# Altium schematic sheet MCU.SchDoc
size A; SheetNumber: 2; SheetTotal: 4
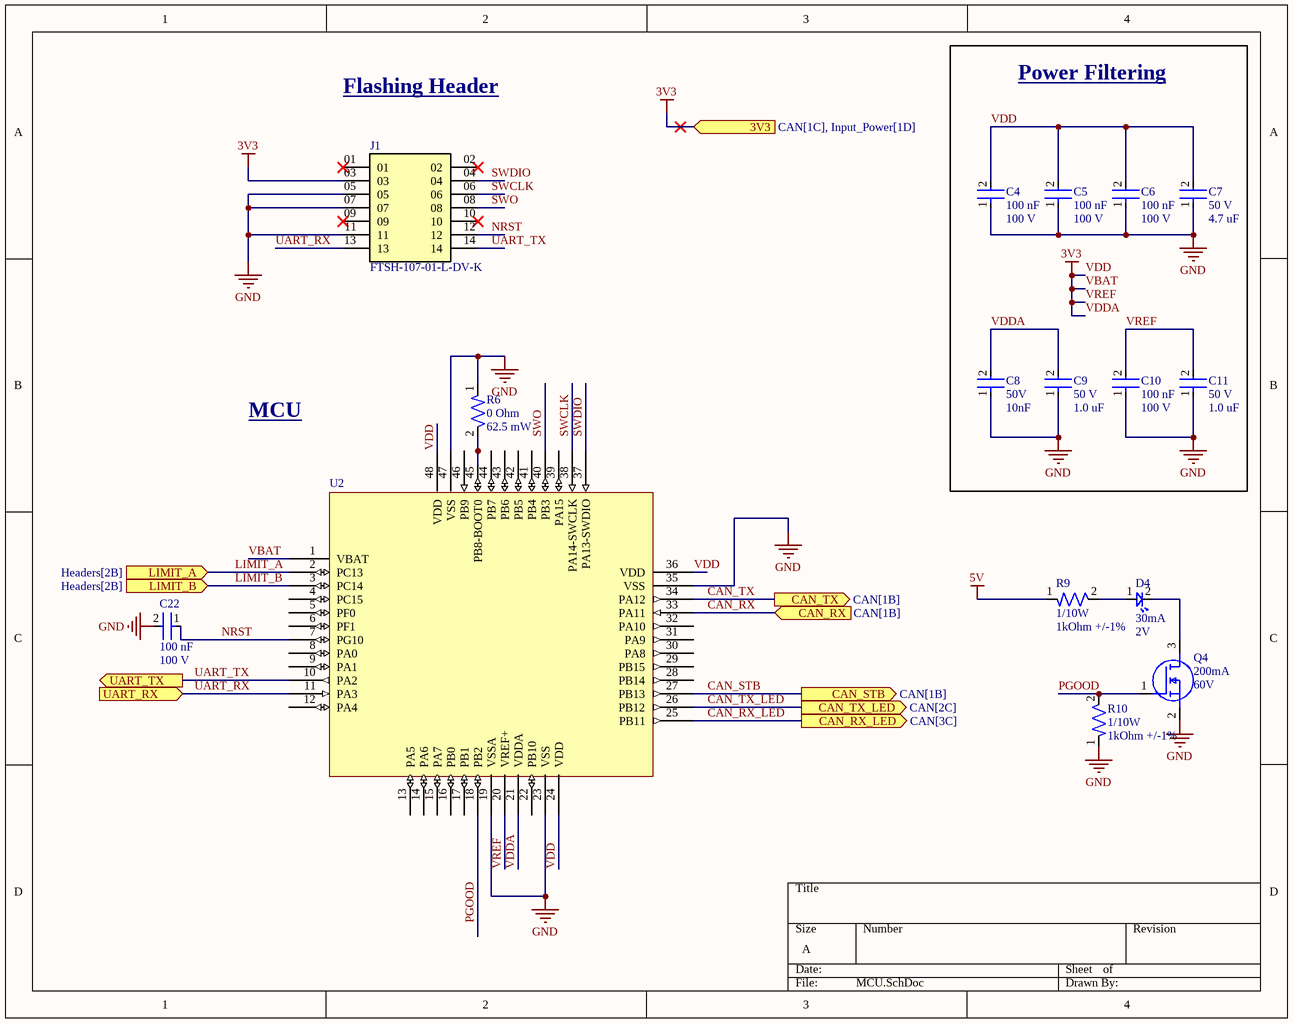
[diagram p0: MCU.SchDoc]

## Parts
C4  Capacitance: 100 nF  Voltage: 100 V  [CAP-0603]  (hidden comment: CC0603KRX7R0BB104)
C5  Capacitance: 100 nF  Voltage: 100 V  [CAP-0603]  (hidden comment: CC0603KRX7R0BB104)
C6  Capacitance: 100 nF  Voltage: 100 V  [CAP-0603]  (hidden comment: CC0603KRX7R0BB104)
C7  Voltage: 50 V  Capacitance: 4.7 uF  [CAP-0805]  (hidden comment: CC0805KKX5R9BB475)
C8  Voltage: 50V  Capacitance: 10nF  [CAP-0805]  (hidden comment: GRM2195C1H103JA01D)
C9  Voltage: 50 V  Capacitance: 1.0 uF  [CAP-0805]  (hidden comment: CC0805KKX7R9BB105)
C10  Capacitance: 100 nF  Voltage: 100 V  [CAP-0603]  (hidden comment: CC0603KRX7R0BB104)
C11  Voltage: 50 V  Capacitance: 1.0 uF  [CAP-0805]  (hidden comment: CC0805KKX7R9BB105)
C22  Capacitance: 100 nF  Voltage: 100 V  [CAP-0603]  (hidden comment: CC0603KRX7R0BB104)
D4  Forward Current: 30mA  Forward Voltage: 2V  [LED-0603]  (hidden comment: BL-HKC36G-AV-TRB)
J1  FTSH-107-01-L-DV-K  [SAMTEC_FTSH-107-01-L-DV-K]
Q4  Continuous Current: 200mA  Voltage: 60V  [IC-SOT23-3]  (hidden comment: T2N7002AK,LM)
R6  Resistance: 0 Ohm  Power: 62.5 mW  [RES-0402]  (hidden comment: RC0402FR-070RL)
R9  Power Rating: 1/10W  Resistance: 1kOhm +/-1%  [RES-0603]  (hidden comment: RT0603FRE131KL)
R10  Power Rating: 1/10W  Resistance: 1kOhm +/-1%  [RES-0603]  (hidden comment: RT0603FRE131KL)
U2  STM32G431CBT6  [IC-LQFP48]  (value not drawn)

## Blocks framed on the sheet
Power Filtering: C4-C11

## Ports
3V3 (in, see CAN[1C], Input_Power[1D]), CAN_RX (in, see CAN[1B]), CAN_RX_LED (out, see CAN[3C]), CAN_STB (out, see CAN[1B]), CAN_TX (out, see CAN[1B]), CAN_TX_LED (out, see CAN[2C]), LIMIT_A (in, see Headers[2B]), LIMIT_B (in, see Headers[2B]), UART_RX (in), UART_TX (out)

## Nets
5V: R9.1
GND: C4.1 C5.1 C6.1 C7.1 C8.1 C9.1 C10.1 C11.1 C22.2 J1.05 J1.07 J1.11 Q4.2(S) R6.1 R10.1 U2.19(VSSA) U2.23(VSS) U2.35(VSS) U2.47(VSS)
VBAT: C4.2 C5.2 C6.2 C7.2 C8.2 C9.2 C10.2 C11.2 J1.03 U2.1(VBAT) U2.20(VREF+) U2.21(VDDA) U2.24(VDD) U2.36(VDD) U2.48(VDD) ; port 3V3  [also labelled 3V3, VDD, VDDA, VREF]
CAN_RX: U2.33(PA11) ; port CAN_RX
CAN_RX_LED: U2.25(PB11) ; port CAN_RX_LED
CAN_STB: U2.27(PB13) ; port CAN_STB
CAN_TX: U2.34(PA12) ; port CAN_TX
CAN_TX_LED: U2.26(PB12) ; port CAN_TX_LED
LIMIT_A: U2.2(PC13) ; port LIMIT_A
LIMIT_B: U2.3(PC14) ; port LIMIT_B
NRST: C22.1 J1.12 U2.7(PG10)
PGOOD: Q4.1(G) R10.2 U2.18(PB2)
SWCLK: J1.06 U2.38(PA14-SWCLK)
SWDIO: J1.04 U2.37(PA13-SWDIO)
SWO: J1.08 U2.40(PB3)
UART_RX: J1.13 U2.11(PA3) ; port UART_RX
UART_TX: J1.14 U2.10(PA2) ; port UART_TX
NetD4_1: D4.1 R9.2
NetD4_2: D4.2 Q4.3(D)
NetR6_2: R6.2 U2.45(PB8-BOOT0)

Not connected (* = marked no-connect by the designer): J1 01* 02* 09* 10*; U2 4(PC15) 5(PF0) 6(PF1) 8(PA0) 9(PA1) 12(PA4) 13(PA5) 14(PA6) 15(PA7) 16(PB0) 17(PB1) 22(PB10) 28(PB14) 29(PB15) 30(PA8) 31(PA9) 32(PA10) 39(PA15) 41(PB4) 42(PB5) 43(PB6) 44(PB7) 46(PB9)

## Notes on the sheet
- Flashing Header
- MCU

## Library data of the parts
C4-C6 C10 C22 = CAP-100N-0001: CAP CER 0.1UF 100V X7R 0603; Device Class: Ceramic; Size: 0603; ComponentLink1Description: Datasheet; ComponentLink1URL: https://www.yageo.com/upload/media/product/app/datasheet/mlcc/upy-np0x7r_mv_100-to-630v.pdf
C7 = CAP-4.7U-0002: CAP CER 4.7UF 50V X5R 0805; ComponentLink2Description: Datasheet; ComponentLink2URL: http://www.yageo.com/documents/recent/UPY-GPHC_Y5V_6.3V-to-50V_8.pdf; Device Class: Ceramic; Size: 0805
C8 = CAP-10N-0001: CAP CER 10000PF 50V C0G/NP0 0805; Device Class: Ceramic; Size: 0805; ComponentLink1Description: Datasheet; ComponentLink1URL: https://search.murata.co.jp/Ceramy/image/img/A01X/G101/ENG/GRM2195C1H103JA01-01.pdf
C9 C11 = CAP-1U-0001: CAP CER 1UF 50V X7R 0805; ComponentLink2URL: https://www.yageo.com/upload/media/product/productsearch/datasheet/mlcc/UPY-GPHC_X7R_6.3V-to-250V_24.pdf; ComponentLink2Description: Datasheet; Device Class: Ceramic; Size: 0805
D4 = LED-0001: LED YELLOW CLEAR 0603 SMD; ComponentLink1Description: Datasheet; ComponentLink1URL: https://www.americanbrightled.com/pdffiles/led-components/smt/BL-HKC36G-AV-TRB.pdf
J1 = CONN_Flashing-0001: Connector Header Surface Mount 14 position 0.050" (1.27mm); MF: Samtec; Value: *; Price: None; Package: None; Availability: Unavailable; MP: FTSH-107-01-L-DV-K; ComponentLink1Description: Datasheet; ComponentLink1URL: https://mm.digikey.com/Volume0/opasdata/d220001/medias/docus/6209/ftsh-1xx-xx-xxx-dv-xxx-xxx-x-xx-mkt.pdf
Q4 = NMOS-200MA-0001: MOSFET N-CH 60V 200MA SOT23; ComponentLink1Description: Datasheet; ComponentLink1URL: https://toshiba.semicon-storage.com/info/T2N7002AK_datasheet_en_20150401.pdf?did=29712&prodName=T2N7002AK
R6 = RES-0-0002-JLC: 62.5mW Thick Film Resistors 50V -55℃~+155℃ 0Ω 0402 Chip Resistor - Surface Mount ROHS; assembled?: yes; JLC part number: C106231
R9 R10 = RES-1K-0002: 1 kOhms ±1% 0.1W, 1/10W Chip Resistor 0603 (1608 Metric) Thin Film; Manufacturer: YAGEO; Assembled?: no; Manufacturer Part Number: RT0603FRE131KL; Package Size: 0603
U2 = IC-STM32G431CBT6: IC MCU 32BIT 128KB FLASH 48LQFP; Package: 48LQFP; ComponentLink1Description: Datasheet; ComponentLink1URL: https://www.st.com/resource/en/datasheet/stm32g431cb.pdf